# Altium schematic sheet Connectors.SchDoc
size 431 x 279 mm; SheetNumber: 2; SheetTotal: 5; ENG_APP_DATE: --/--/--; DSN_APP_DATE: --/--/--; CHK_APP_DATE: --/--/--
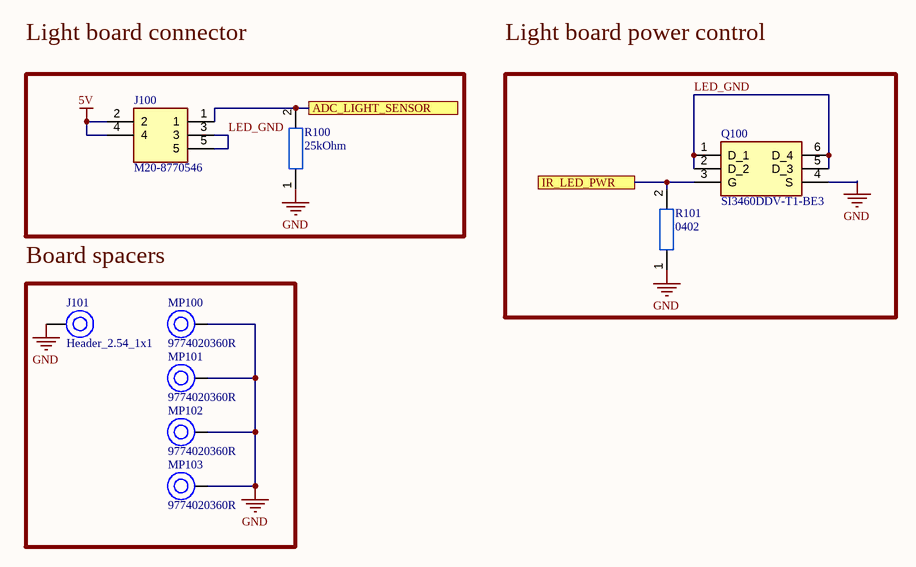
[diagram p0: Connectors.SchDoc]

## Parts
J100  M20-8770546  [M208770546]
J101  Header_2.54_1x1  [HEADER_2.54_1x1]
MP100  9774020360R  [9774020360]
MP101  9774020360R  [9774020360]
MP102  9774020360R  [9774020360]
MP103  9774020360R  [9774020360]
Q100  SI3460DDV-T1-BE3  [SOT95P284X110-6N]
R100  25kOhm  [0402_footprint]
R101  0402  [0402_footprint]

## Blocks framed on the sheet
Board spacers: J101 MP100-MP103

## Ports
ADC_LIGHT_SENSOR, IR_LED_PWR

## Nets
5V: J100.2 J100.4
GND: J101.0 MP100.1 MP101.1 MP102.1 MP103.1 Q100.4(S) R100.1 R101.1
ADC_LIGHT_SENSOR: J100.1 R100.2 ; port ADC_LIGHT_SENSOR
IR_LED_PWR: Q100.3(G) R101.2 ; port IR_LED_PWR
LED_GND: J100.3 J100.5 Q100.1(D_1) Q100.2(D_2) Q100.5(D_3) Q100.6(D_4)

## Notes on the sheet
- Light board connector
- Light board power control
- DWG. NO.
- REV.
- SHT.
- THIS DOCUMENT AND THE DATA DISCLOSED HEREIN OR HEREWITH IS THE PROPERTY OF ALTIUM LIMITED AND MAY BE FREELY DISTRIBUTED IN WHOLE. NO RIGHTS ARE RESERVED OR EXPRESS OR IMPLIED WARANTEE GIVEN.
- REVISION
- DESCRIPTION
- DATE
- APPROVED
- ENG:
- APPROVALS
- PROJECT
- DSN:
- CHK:
- REFERENCE DOCUMENTS
- PROJECT REVISION:
- TITLE
- DOCUMENT REVISION:
- DESIGN ITEM:
- BOM:
- FAB DWG:
- PCB DWG:
- ASSY DWG:
- SCALE:
- SIZE
- B
- CAGE CODE
- FILE NAME
- DWG NO.
- SHEET
- OF
- REV

## Library data of the parts
J100 = M20-8770546: SMD 5 pin connector; Manufacturer_Name: Harwin; Datasheet Link: https://cdn.harwin.com/pdfs/M20-877.pdf; Height: 10.01mm; Manufacturer_Part_Number: M20-8770546; Mouser Part Number: 855-M20-8770546; Mouser Price/Stock: https://www.mouser.co.uk/ProductDetail/Harwin/M20-8770546?qs=ulE8k0yEMYbi%252BxzjuY0x2Q%3D%3D; ComponentLink1Description: Buy; ComponentLink1URL: https://www.mouser.lt/ProductDetail/Amphenol-FCI/10129380-910002ALF?qs=0lQeLiL1qybuIOWgC6EkxQ%3D%3D
MP100-MP103 = CMP-208001-000010-2: SMT STEEL SPACER, M3 INTERNAL NO; NexarPartId: 75603355; Material: Steel; Min Operating Temperature: -55°C; Packaging: Tape and Reel; Length: 2mm; RoHS: Compliant; Height: 3.5mm; Max Operating Temperature: 150°C; Width: 6mm
Q100 = SI3460DDV-T1-BE3: MOSFET (N-Channel); Manufacturer_Name: Vishay; Datasheet Link: https://www.mouser.com/datasheet/2/427/SI3460DD-1764976.pdf; Height: 1.1mm; Manufacturer_Part_Number: SI3460DDV-T1-BE3; Mouser Part Number: 78-SI3460DDV-T1-BE3; Mouser Price/Stock: https://www.mouser.co.uk/ProductDetail/Vishay-Siliconix/SI3460DDV-T1-BE3?qs=CiayqK2gdcJwCX50G4xrrA%3D%3D; ComponentLink1Description: Buy; ComponentLink1URL: https://www.mouser.lt/ProductDetail/Vishay-Siliconix/SI3460DDV-T1-BE3?qs=CiayqK2gdcJwCX50G4xrrA%3D%3D
R100 R101 = Resistor_0402: 0402 resistor